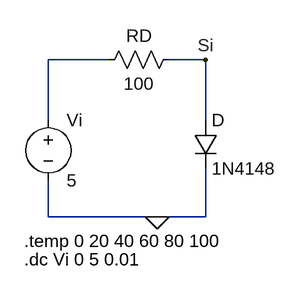
[diagram p0: schematic Versuch4_Lab1.asc]
Versuch4_Lab1.asc, the LTspice schematic file:
Version 4
SHEET 1 1456 680
WIRE 144 32 64 32
WIRE 272 32 224 32
WIRE 64 112 64 32
WIRE 272 112 272 32
WIRE 64 240 64 192
WIRE 208 240 64 240
WIRE 272 240 272 176
WIRE 272 240 208 240
FLAG 272 32 Si
FLAG 208 240 0
SYMBOL voltage 64 96 R0
SYMATTR InstName Vi
SYMATTR Value 5
SYMBOL res 240 16 R90
WINDOW 0 0 56 VBottom 2
WINDOW 3 32 56 VTop 2
SYMATTR InstName RD
SYMATTR Value 100
SYMBOL diode 256 112 R0
SYMATTR InstName D
SYMATTR Value 1N4148
TEXT 32 296 Left 2 !.dc Vi 0 5 0.01
TEXT 32 272 Left 2 !.temp 0 20 40 60 80 100

The netlist it stands for:
* Versuch4_Lab1.asc
Vi N001 0 5
RD Si N001 100
D Si 0 1N4148
.model D D
.lib standard.dio
.dc Vi 0 5 0.01
.temp 0 20 40 60 80 100
.backanno
.end